# EAGLE design lcd_thermocouple_two (EAGLE 6.0)
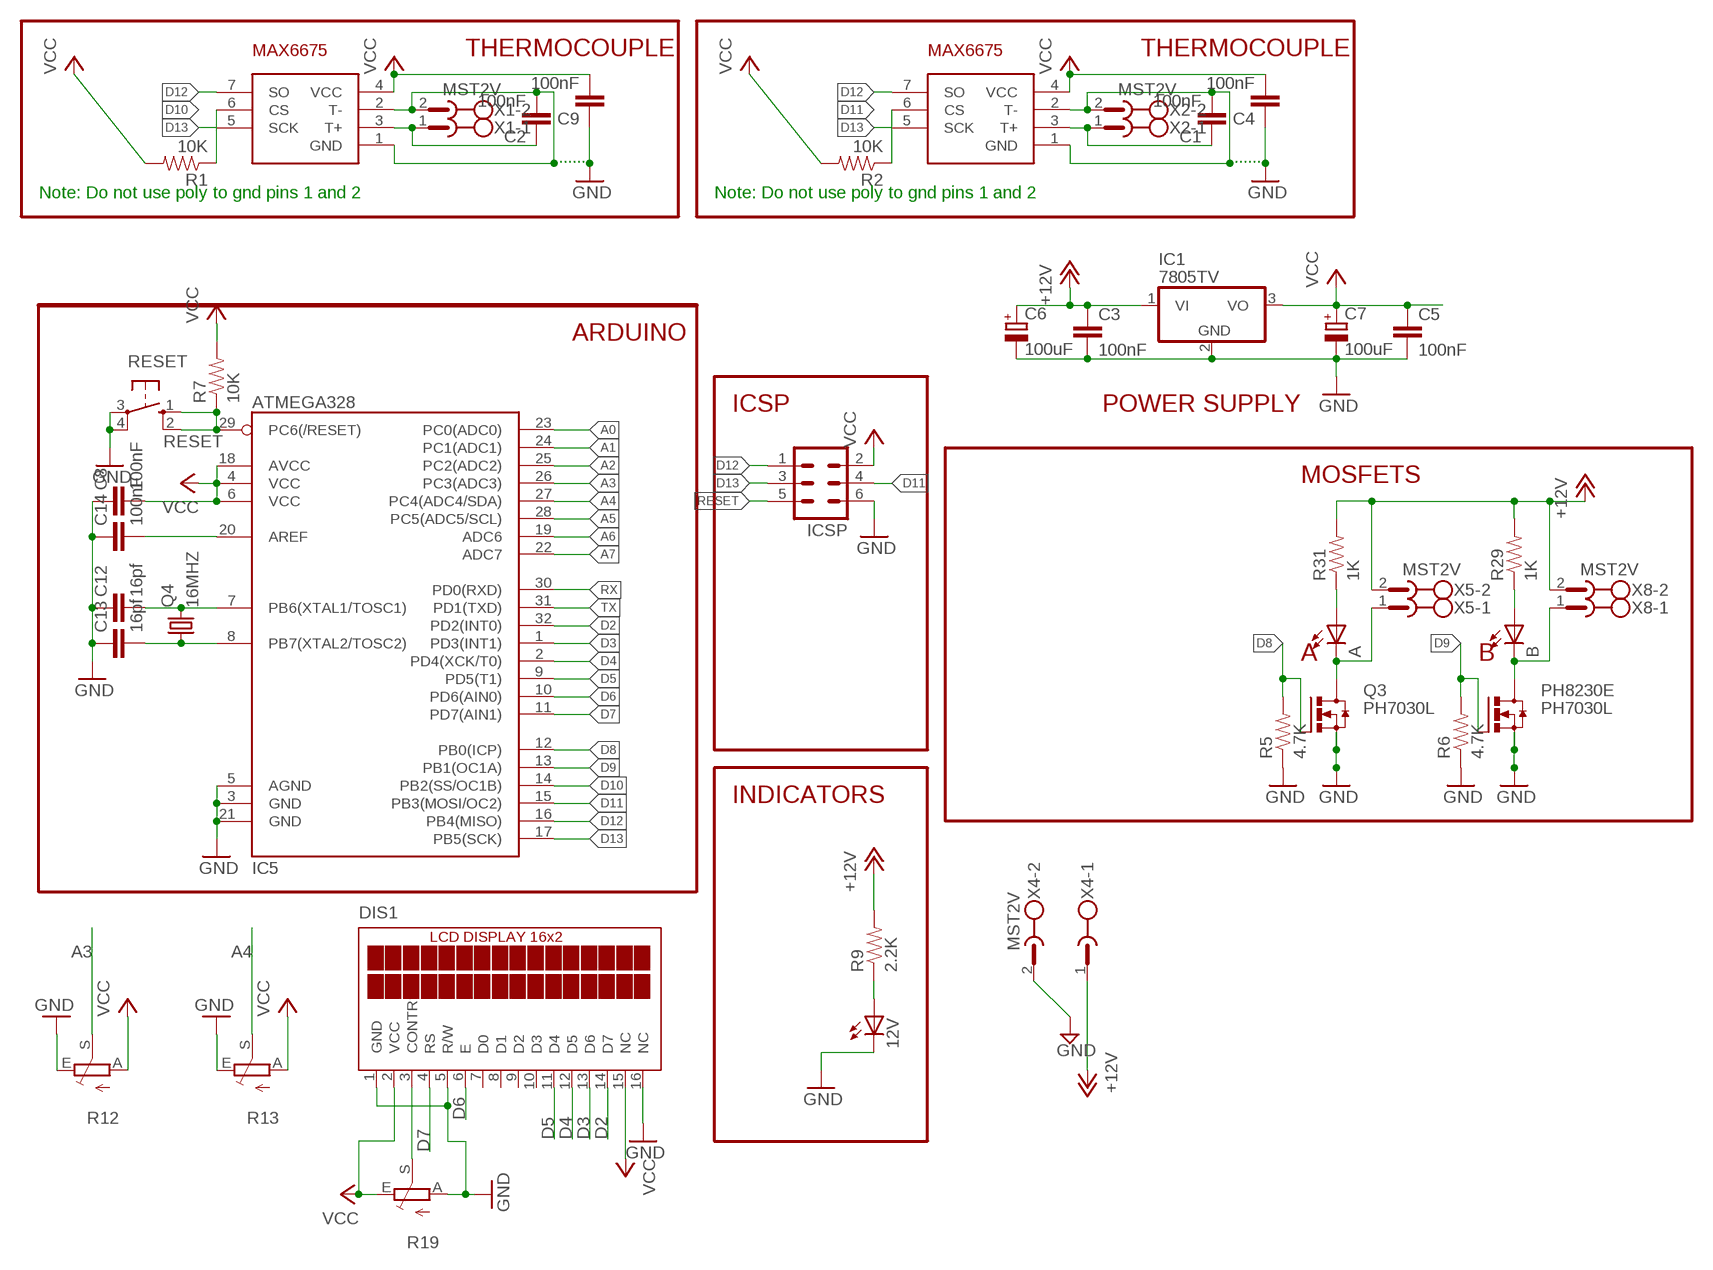
[diagram p0: schematic, sheet 1]

## Parts
12V  LED0805  [LED-0805]
A  LED0805  [LED-0805]
B  LED0805  [LED-0805]
C1  100nF  CAP0805  [0805]
C2  100nF  CAP0805  [0805]
C3  100nF  CAP0805  [0805]
C4  100nF  CAP0805  [0805]
C5  100nF  CAP0805  [0805]
C6  100uF  CPOL-EUE3.5-8  [E3,5-8]
C7  100uF  CPOL-EUE3.5-8  [E3,5-8]
C8  100nF  CAP0805  [0805]
C9  100nF  CAP0805  [0805]
C12  16pf  CAP0805  [0805]
C13  16pf  CAP0805  [0805]
C14  100nF  CAP0805  [0805]
DIS1  TUXGR_16X2_R2  [TUXGR_16X2_R2]
IC1  7805TV  [TO220V]
IC2  MAX6675  [SO08]
IC5  ATMEGA328  ATMEGA168  [TQFP32-08]
IC8  MAX6675  [SO08]
ICSP  ML6  [ML6]
PH8230E  PH7030L  [SOT669]
Q3  PH7030L  [SOT669]
Q4  16MHZ  CRYSTALHC49S  [HC49/S]
R1  10K  RESISTOR  [0805]
R2  10K  RESISTOR  [0805]
R5  4.7K  RESISTOR  [0805]
R6  4.7K  RESISTOR  [0805]
R7  10K  RESISTOR  [0805]
R9  2.2K  RESISTOR  [0805]
R12  TRIM_EU-B25U  [B25U]
R13  TRIM_EU-B25U  [B25U]
R19  TRIM_EU-B25P  [B25P]
R29  1K  RESISTOR  [0805]
R31  1K  RESISTOR  [0805]
RESET  10-XX  [B3F-10XX]
X1  MST2V  [MSTBV2]
X2  MST2V  [MSTBV2]
X4  MST2V  [MSTBV2]
X5  MST2V  [MSTBV2]
X8  MST2V  [MSTBV2]

## Nets
+12V [motors]: C3.1 C6.+ IC1.1(VI) R9.2 R29.2 R31.2 X4.1 X5.2 X8.2
A0: IC5.23(PC0(ADC0))
A1: IC5.24(PC1(ADC1))
A2: IC5.25(PC2(ADC2))
A3: IC5.26(PC3(ADC3)) R12.S
A4: IC5.27(PC4(ADC4/SDA)) R13.S
A5: IC5.28(PC5(ADC5/SCL))
A6: IC5.19(ADC6)
A7: IC5.22(ADC7)
APWR [motors]: A.C Q3.MB(D) X5.1
BPWR [motors]: B.C PH8230E.MB(D) X8.1
D2: DIS1.14(D7) IC5.32(PD2(INT0))
D3: DIS1.13(D6) IC5.1(PD3(INT1))
D4: DIS1.12(D5) IC5.2(PD4(XCK/T0))
D5: DIS1.11(D4) IC5.9(PD5(T1))
D6: DIS1.6(E) IC5.10(PD6(AIN0))
D7: DIS1.4(RS) IC5.11(PD7(AIN1))
D8: IC5.12(PB0(ICP)) Q3.4(G) R5.2
D9: IC5.13(PB1(OC1A)) PH8230E.4(G) R6.2
D10: IC5.14(PB2(SS/OC1B)) IC8.6(CS) R1.1
D11: IC2.6(CS) IC5.15(PB3(MOSI/OC2)) ICSP.4 R2.1
D12: IC2.7(SO) IC5.16(PB4(MISO)) IC8.7(SO) ICSP.1
D13: IC2.5(SCK) IC5.17(PB5(SCK)) IC8.5(SCK) ICSP.3
GND [motors]: 12V.C C3.2 C4.1 C5.2 C6.- C7.- C8.1 C9.1 C12.1 C13.1 C14.1 DIS1.1(GND) DIS1.5(R/W) DIS1.16(NC) IC1.2(GND) IC5.3(GND) IC5.5(AGND) IC5.21(GND) ICSP.6 PH8230E.1(S) PH8230E.2(S) PH8230E.3(S) Q3.1(S) Q3.2(S) Q3.3(S) R5.1 R6.1 R12.E R13.E R19.A RESET.3(P) RESET.4(P1) X4.2
N$1: C2.2 IC8.1(GND) IC8.2(T-) X1.2
N$2: C1.1 IC2.3(T+) X2.1
N$3: C1.2 IC2.1(GND) IC2.2(T-) X2.2
N$11: C2.1 IC8.3(T+) X1.1
N$20: C14.2 IC5.20(AREF)
N$26: 12V.A R9.1
N$29: DIS1.3(CONTR) R19.S
N$31: C12.2 IC5.7(PB6(XTAL1/TOSC1)) Q4.2
N$32: C13.2 IC5.8(PB7(XTAL2/TOSC2)) Q4.1
N$41: A.A R31.1
N$42: B.A R29.1
RESET: IC5.29(PC6(/RESET)) ICSP.5 R7.1 RESET.1(S) RESET.2(S1)
RX: IC5.30(PD0(RXD))
TX: IC5.31(PD1(TXD))
VCC: C4.2 C5.1 C7.+ C8.2 C9.2 DIS1.2(VCC) DIS1.15(NC) IC1.3(VO) IC2.4(VCC) IC5.4(VCC) IC5.6(VCC) IC5.18(AVCC) IC8.4(VCC) ICSP.2 R1.2 R2.2 R7.2 R12.A R13.A R19.E
Unconnected: DIS1.7(D0) DIS1.8(D1) DIS1.9(D2) DIS1.10(D3)

## Notes on the sheet
- THERMOCOUPLE | THERMOCOUPLE
- ....... | .......
- Note: Do not use poly to gnd pins 1 and 2 | Note: Do not use poly to gnd pins 1 and 2
- ARDUINO
- ICSP | POWER SUPPLY
- MOSFETS
- A | B
- INDICATORS

## Library data of the parts
12V A B = SparkFun:LED: LEDs Standard schematic elements and footprints for 5mm, 3mm, 1206, and 0603 sized LEDs. 5mm - Spark Fun Electronics SKU : COM-00529 (and others)
C1-C5 C8 C9 C12-C14 = SparkFun:CAP: Capacitor Standard 0603 ceramic capacitor, and 0.1" leaded capacitor.
C6 C7 = rcl:CPOL-EU: POLARIZED CAPACITOR, European symbol
DIS1 = display-lcd:TUXGR_16X2_R2: Tuxgraphics LCD display 16x2 characters reflective, without background light Source: tuxgr_12x2_r2.pdf
IC1 = linear:78*: Positive VOLTAGE REGULATOR Source: http://cache.national.com/ds/LM/LM78L05.pdf http://www.fairchildsemi.com/ds/LM/LM7805.pdf
IC2 IC8 = reprap:MAX6675: Thermocouple amplifier and A to D converter
IC5 = SparkFun:ATMEGA168
ICSP = con-harting-ml:ML6: HARTING
PH8230E Q3 = transistor-power:PH7030L: N-channel TrenchMOS (TM) logic level FET Source: http://www.nxp.com/acrobat_download/datasheets/PH7030L_4.pdf
Q4 = crystal:CRYSTAL: CRYSTAL
R1 R2 R5-R7 R9 R29 R31 = SparkFun:RESISTOR: Resistor Basic schematic elements and footprints for 0603, 1206, and PTH 1/10th watt (small) resistors.
R12 R13 R19 = pot:TRIM_EU-: POTENTIOMETER
RESET = switch-omron:10-XX: OMRON SWITCH
X1 X2 X4 X5 X8 = con-phoenix-508:MST2V: PHOENIX

## Net classes
0 default: width 0.305 mm
1 vcc: width 0.305 mm
2 motors: width 1.016 mm

## Board
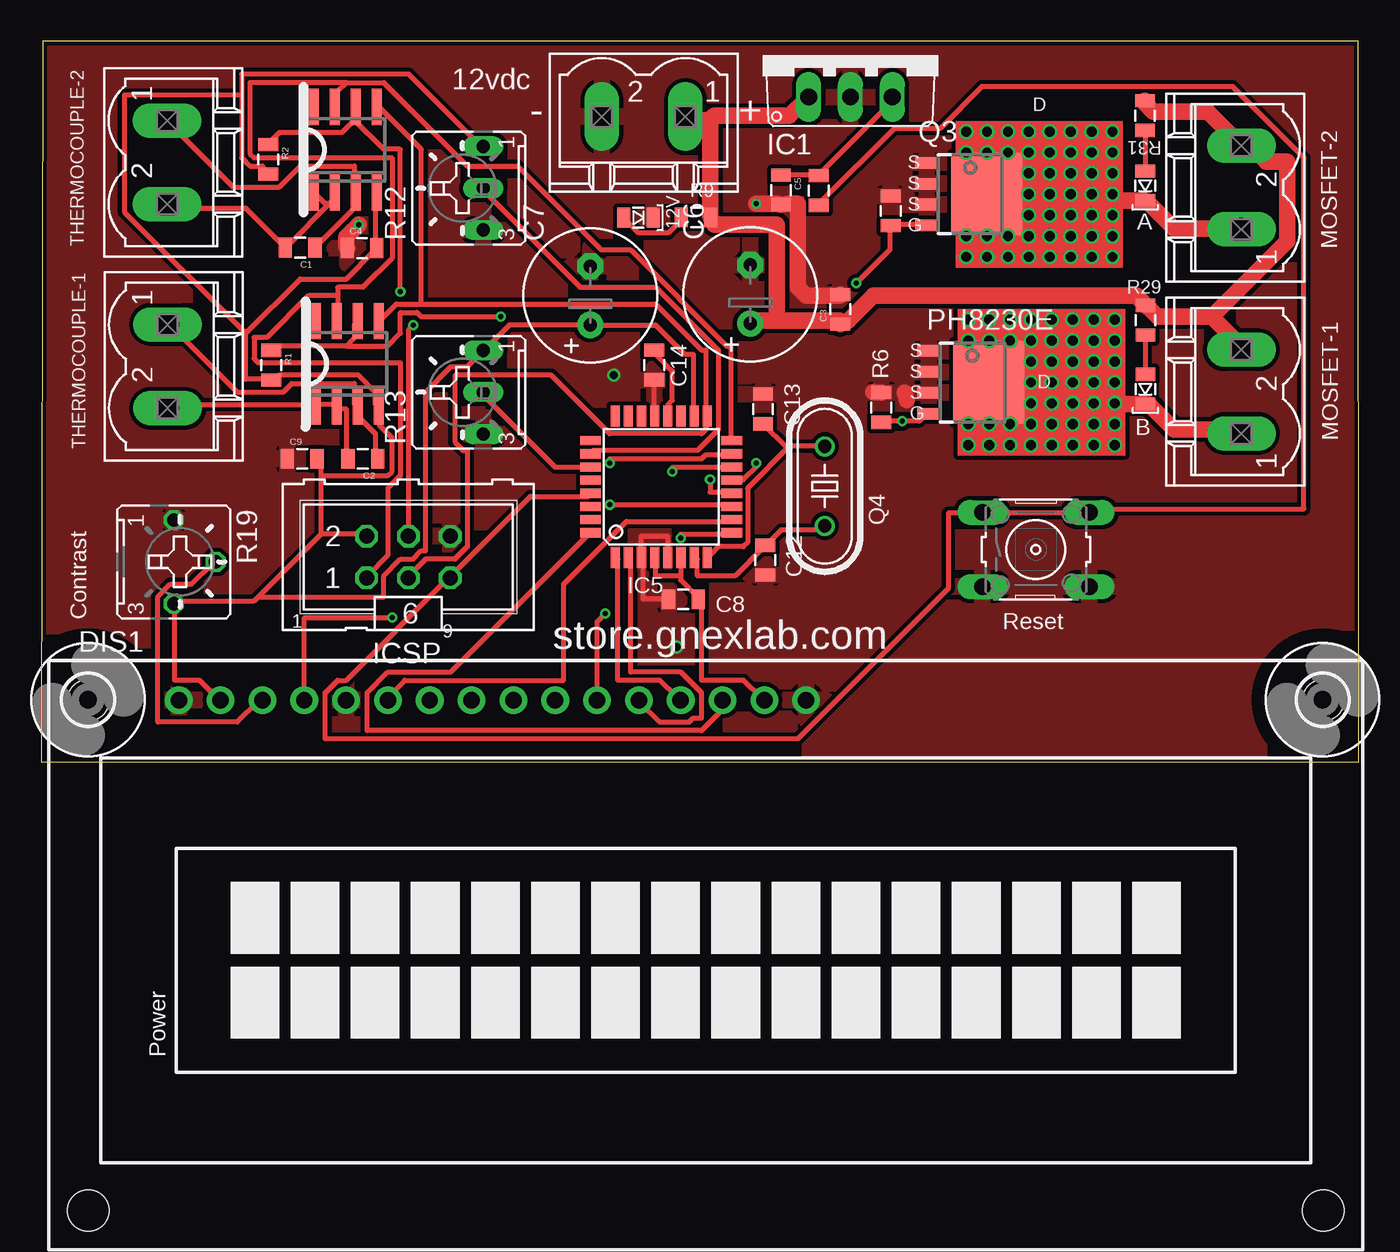
[diagram p1: board, top side]
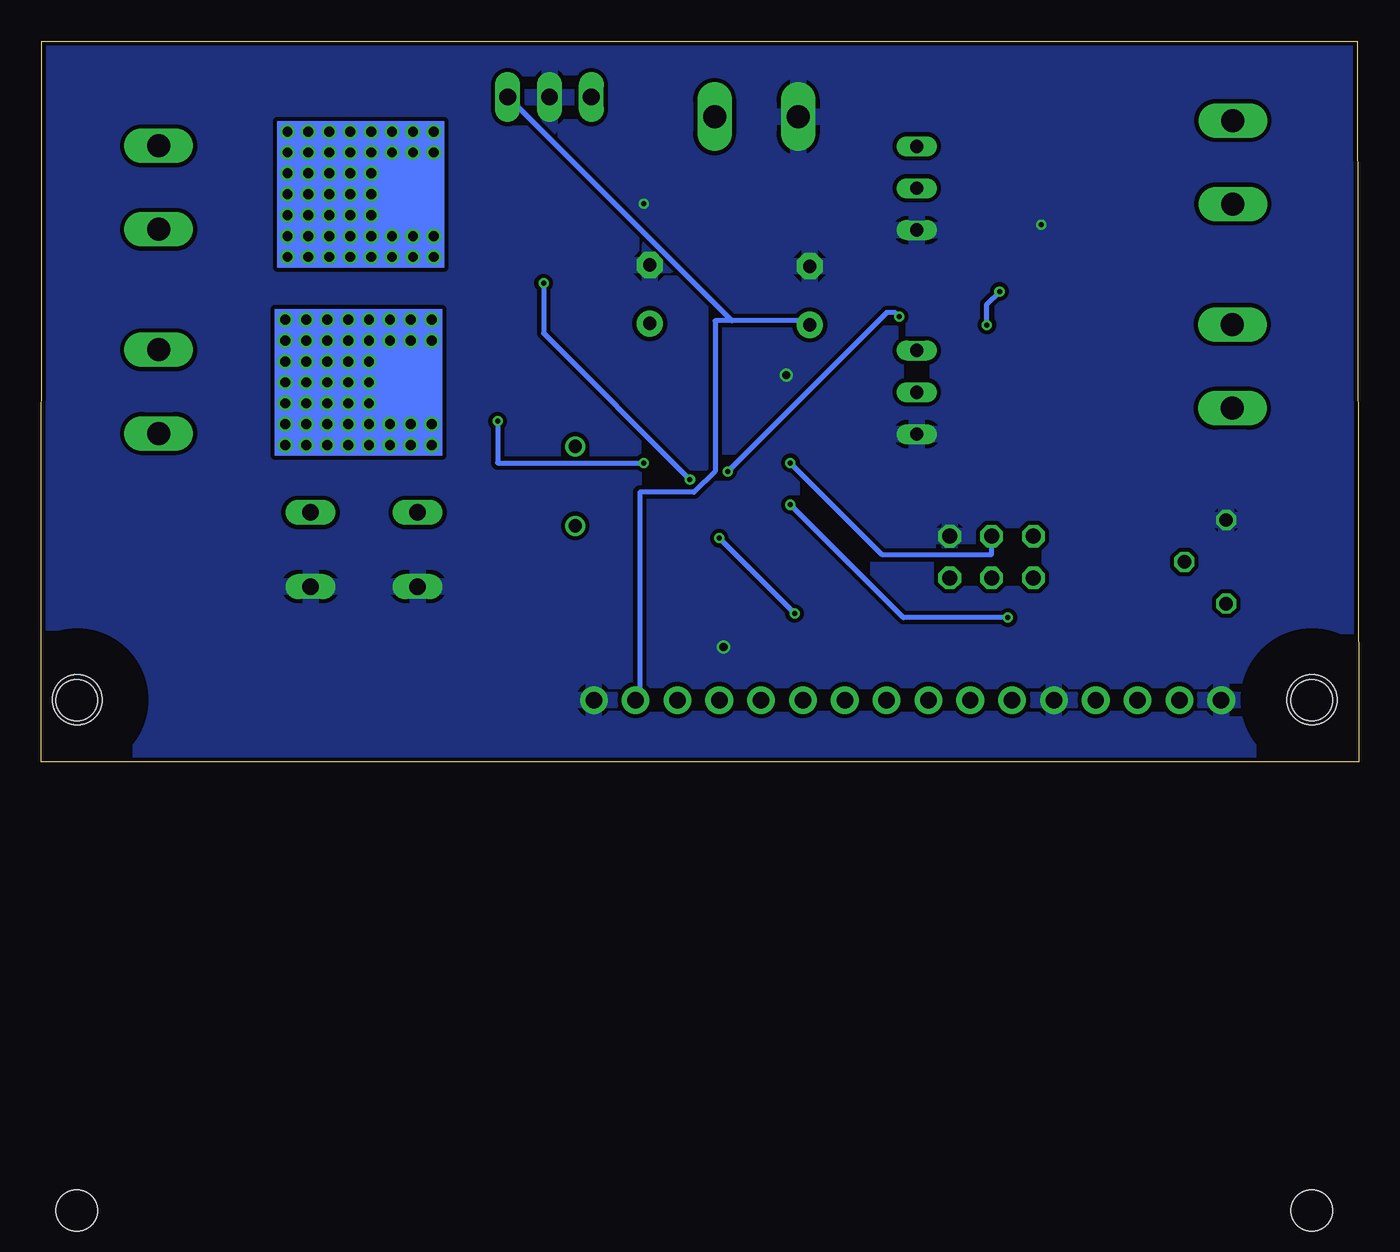
[diagram p2: board, bottom side, seen from below]

Size 80.01 x 43.8 mm. Coordinates in mm from the lower left corner, seen from the top.
Outline: 0,0 80.01,0 79.98,43.8 0.09,43.8 0,0
Copper layers (1*2*15*16): Top 0.035mm / dielectric 0.2mm / Route2 0.0175mm / dielectric 1.1mm / Route15 0.0175mm / dielectric 0.2mm / Bottom 0.035mm
Design rules: minimum track width 6mil, minimum drill 12mil, track to track 6mil, track to pad 6mil, pad to pad 6mil, via to via 6mil, smd to smd 0mil, copper to edge 10mil, drill to drill 10mil, minimum pad ring 6mil, minimum via ring 6mil, stop-mask expansion 2mil, vias tented up to drill 25mil, thermal gap 10mil

### Footprints (pad centres in the part's own frame; a part is rotated, then mirrored left to right if it is on the bottom)
LED-0805 = smd 1.2 x 0.8: A 0,-0.9; C 0,0.9
0805 = smd 0.8 x 1.2: 1 -0.9,0; 2 0.9,0
E3,5-8 = drill 0.813 pad 1.6: + -1.778,0 | drill 0.813 pad 1.6 octagon: - 1.778,0
TUXGR_16X2_R2 = drill 1 pad 1.676: 1 -32,15.5; 2 -29.46,15.5; 3 -26.92,15.5; 4 -24.38,15.5; 5 -21.84,15.5; 6 -19.3,15.5; 7 -16.76,15.5; 8 -14.22,15.5; 9 -11.68,15.5; 10 -9.14,15.5; 11 -6.6,15.5; 12 -4.06,15.5; 13 -1.52,15.5; 14 1.02,15.5; 15 3.56,15.5; 16 6.1,15.5 | hole 2.5: -37.5,-15.5; 37.5,-15.5; -37.5,15.5; 37.5,15.5
TO220V = drill 1.016 long: 1 -2.54,-2.54; 2 0,-2.54; 3 2.54,-2.54
SO08 = smd 0.6 x 2.2: 1 -1.905,-2.6; 2 -0.635,-2.6; 3 0.635,-2.6; 4 1.905,-2.6; 5 1.905,2.6; 6 0.635,2.6; 7 -0.635,2.6; 8 -1.905,2.6
TQFP32-08 = smd 1.27 x 0.559: 1 -4.293,2.8; 2 -4.293,2; 3 -4.293,1.2; 4 -4.293,0.4; 5 -4.293,-0.4; 6 -4.293,-1.2; 7 -4.293,-2; 8 -4.293,-2.8; 17 4.293,-2.8; 18 4.293,-2; 19 4.293,-1.2; 20 4.293,-0.4; 21 4.293,0.4; 22 4.293,1.2; 23 4.293,2; 24 4.293,2.8 | smd 0.559 x 1.27: 9 -2.8,-4.293; 10 -2,-4.293; 11 -1.2,-4.293; 12 -0.4,-4.293; 13 0.4,-4.293; 14 1.2,-4.293; 15 2,-4.293; 16 2.8,-4.293; 25 2.8,4.293; 26 2,4.293; 27 1.2,4.293; 28 0.4,4.293; 29 -0.4,4.293; 30 -1.2,4.293; 31 -2,4.293; 32 -2.8,4.293
ML6 = drill 0.914 octagon: 1 -2.54,-1.27; 2 -2.54,1.27; 3 0,-1.27; 4 0,1.27; 5 2.54,-1.27; 6 2.54,1.27
SOT669 = smd 0.7 x 1.4: 1 -1.905,-2.65; 2 -0.635,-2.65; 3 0.635,-2.65; 4 1.905,-2.65 | smd 5 x 4.3: MB 0,1
HC49/S = drill 0.813: 1 -2.413,0; 2 2.413,0
B25U = drill 0.813 long: A 2.54,-0.889; E -2.54,-0.889; S 0,-0.889
B25P = drill 0.813 octagon: A -2.54,0; E 2.54,0; S 0,2.54
B3F-10XX = drill 1.016 long: 1 -3.251,2.261; 2 3.251,2.261; 3 -3.251,-2.261; 4 3.251,-2.261
3,0 = hole 3: 0,0
MSTBV2 = drill 1.397 long: 1 -2.54,0; 2 2.54,0

### Placement (x,y rotation side)
12V  36.27,33.08 270 top
A  67.04,35.01 180 top
B  67.06,22.66 180 top
C1  15.72,31.26 180 top
C2  19.53,18.43 180 top
C3  48.52,27.51 90 top
C4  19.48,31.23 0 top
C5  44.92,34.76 270 top
C6  43.06,28.42 90 top
C7  33.34,28.35 90 top
C8  39,9.9 0 top
C9  15.85,18.43 0 top
C12  43.97,12.28 90 top
C13  43.84,21.46 270 top
C14  37.24,24.12 90 top
DIS1  40.36,-11.73 0 top
IC1  49.15,42.94 0 top
IC2  18.47,37.2 0 top
IC5  37.65,16.73 90 top
IC8  18.59,24.2 0 top
ICSP  22.3,12.46 0 top
PH8230E  56.55,23.07 270 top
Q3  56.42,34.5 270 top
Q4  47.58,16.77 270 top
R1  13.97,24.12 270 top
R2  13.79,36.62 270 top
R5  51.6,33.49 270 top
R6  51.01,21.55 270 top
R7  47.22,34.73 90 top
R9  39.76,33.09 0 top
R12  25.96,34.87 90 top
R13  25.96,22.47 90 top
R19  8.06,12.17 270 top
R29  67.06,26.85 90 top
R31  67.02,39.28 90 top
RESET  60.41,12.92 0 top
U$1  [3,0]  2.84,3.79 0 top
U$4  [3,0]  77.82,3.79 0 top
X1  7.67,24.04 270 top
X2  7.65,36.44 270 top
X4  36.58,39.22 180 top
X5  72.88,34.91 90 top
X8  72.88,22.51 90 top

### Tracks (layer width: path | path; a pad name or v marks a point on that pad's centre or on a via)
+12V
  Top 1.016: 71.1,27.07 67.79,27.07 67.29,27.57 R29.2 66.78,28.08 66.52,28.34 50.52,28.34 49,26.81 C3.1 48.49,26.81 44.68,26.81 | 71.1,27.07 72.87,25.29 X8.2 | R31.2 67.03,40.02 67.54,39.51 70.84,39.51 72.87,37.48 X5.2 73.38,37.48 74.4,36.46 75.67,36.46 75.67,31.64 71.1,27.07 | 44.68,26.81 43.16,26.81 C6.+ | 40.62,39 40.62,33.16 R9.2 40.87,32.65 44.68,32.65 44.68,26.81 | 40.62,39 39.35,39 X4.1 | IC1.1 46.46,40.27 45.44,39.26 40.87,39.26 40.62,39
A3
  Top 0.305: IC5.26 33.5,18.94 39.85,18.94 41.12,20.21 41.12,25.03 37.31,28.84 32.74,28.84 26.9,34.69 R12.S
A4
  Top 0.305: IC5.27 33.25,17.92 31.22,17.92 26.9,22.24 R13.S
APWR
  Top 1.016: X5.1 72.87,32.4 68.81,32.4 67.29,33.92 A.C 57.42,34.11 Q3.MB
BPWR
  Top 1.016: X8.1 72.87,20.21 68.81,20.21 67.29,21.73 B.C 57.55,21.76 PH8230E.MB
D2
  Top 0.305: IC5.32 33.25,13.86 24.87,5.48 21.06,5.48 19.79,4.21 19.79,1.92 40.11,1.92 41.12,2.94 41.12,3.7 DIS1.14
D3
  Top 0.305: IC5.1 35.03,12.33 35.03,4.97 37.57,4.97 38.58,3.95 DIS1.13
D4
  Top 0.305: IC5.2 35.79,12.33 35.79,5.48 38.84,5.48 40.11,4.21 40.11,2.68 39.6,2.68 39.35,2.43 37.57,2.43 36.3,3.7 DIS1.12
D5  (via drill 0.3)
  Top 0.305: v38.84,13.6 38.84,13.86 41.89,13.86 IC5.9 | v34.27,9.03 33.76,8.52 33.76,3.95 DIS1.11
  Bottom 0.305: v34.27,9.03 v38.84,13.6
D6
  Top 0.305: IC5.10 41.89,14.62 35.54,14.62 31.73,10.81 31.73,4.97 22.07,4.97 21.06,3.95 DIS1.6
D7  (via drill 0.3)
  Top 0.305: v34.52,15.64 41.89,15.64 IC5.11 | v21.31,8.78 15.98,8.78 15.98,3.95 DIS1.4
  Bottom 0.305: v34.52,15.64 27.66,8.78 v21.31,8.78
D8  (via drill 0.3)
  Top 0.305: Q3.4 53.57,32.65 51.79,32.65 R5.2 51.54,32.4 51.54,31.13 v49.51,29.1 | v40.62,17.16 40.62,16.4 41.89,16.4 IC5.12
  Bottom 0.305: v40.62,17.16 49.51,26.05 v49.51,29.1
D9  (via drill 0.3)
  Top 0.305: R6.2 51.03,20.72 v52.3,20.72 53.32,20.72 53.82,21.22 PH8230E.4 | v43.41,18.18 43.41,17.92 42.65,17.16 42.14,17.16 IC5.13
  Bottom 0.305: v43.41,18.18 52.3,18.18 v52.3,20.72
D10  (via drill 0.3)
  Top 0.305: 18.52,25.29 14.45,25.29 14.2,25.03 R1.1 | 18.52,25.29 19.03,25.8 19.03,26.56 IC8.6 | v38.33,17.67 38.33,17.92 41.89,17.92 IC5.14 | v27.92,27.07 23.09,27.07 22.84,27.32 21.82,27.32 21.82,26.05 21.06,25.29 18.52,25.29
  Bottom 0.305: v38.33,17.67 28.68,27.32 28.17,27.32 v27.92,27.07
D11  (via drill 0.3)
  Top 0.305: 19.03,39 18.26,38.24 14.45,38.24 13.95,37.73 R2.1 | 19.03,39 19.03,39.77 IC2.6 19.03,39 | v34.52,18.18 34.52,18.43 40.11,18.43 40.36,18.68 41.89,18.68 IC5.15 | 19.03,39 20.8,37.23 21.82,37.23 v21.82,28.59 | v22.58,26.56 22.33,26.3 22.33,13.86 ICSP.4
  Bottom 0.305: v34.52,18.18 28.93,12.59 22.33,12.59 22.33,13.6 ICSP.4 | v21.82,28.59 22.58,27.83 v22.58,26.56
D12
  Top 0.305: 18.52,41.29 20.8,41.29 25.88,36.21 28.93,36.21 34.01,31.13 35.79,31.13 41.63,25.29 41.89,25.29 41.89,19.7 IC5.16 | 18.52,41.29 18.01,40.78 18.01,40.02 IC2.7 | 18.01,28.34 18.01,28.84 19.53,28.84 21.31,30.62 21.31,36.72 12.93,36.72 12.68,36.97 12.68,41.29 18.52,41.29 | 18.01,28.34 18.01,26.81 IC8.7 | 18.01,28.34 16.23,28.34 13.69,25.8 12.93,25.8 12.93,24.53 13.18,24.27 21.82,24.27 21.82,17.41 21.06,16.65 21.06,12.59 19.79,11.32 ICSP.1
D13
  Top 0.305: 23.09,27.83 21.57,27.83 20.55,26.81 IC8.5 | 23.09,27.83 37.31,27.83 40.11,25.03 40.36,25.03 40.36,21.22 IC5.17 40.36,20.97 40.36,20.21 40.11,19.95 34.52,19.95 30.96,23.51 25.12,23.51 25.12,19.45 25.63,18.94 25.88,18.94 25.88,13.1 25.12,12.33 23.34,12.33 22.33,11.32 ICSP.3 | 23.09,27.83 23.09,37.23 20.55,39.77 IC2.5
GND  (via drill 0.3, 0.5)
  Top 0.305: 37.24,21.02 C14.1 | 36.42,12.44 36.42,13.73 38.05,13.73 IC5.5 | C8.1 36.55,9.9 36.55,12.44
  Top 0.406: IC5.21 37.24,21.02 | 36.42,12.44 IC5.3 36.55,12.44
  Top 1.016: v19.28,32.65 18.52,31.89 18.52,31.38 C4.1 | v43.41,33.92 44.68,33.92 C5.2 45.44,33.92 45.95,33.92 45.95,28.84 46.46,28.34 48.49,28.34 C3.2 | 52.55,21.99 52.44,22.44 | 50.52,22.49 R6.1 | 8.36,3.95 DIS1.1 | 8.36,3.95 DIS1.1 | 8.36,3.95 DIS1.1
  other vias: 34.77,23.51 38.58,7
  pour Top (isolate 0.254): -12.46,46.06 83.52,44.86 83.33,-7.61 -12.14,-7.5
  pour Bottom (isolate 0.254): -6.14,46.77 81.66,47.21 80.54,-4.03 -6.61,-4.89
N$1
  Top 0.305: C2.2 18.52,18.43 18.52,21.48 18.01,21.48 IC8.2 17.76,21.73 16.74,21.73 IC8.1 16.49,21.73 7.85,21.73 X1.2
N$2
  Top 0.305: C1.1 16.74,31.38 19.03,33.67 19.03,34.43 IC2.3 19.03,34.69 19.03,36.21 15.72,36.21 14.45,34.94 11.66,34.94 7.85,38.75 X2.1
N$3
  Top 0.305: 17.5,33.92 18.01,34.43 IC2.2 | 17.5,33.92 14.96,31.38 C1.2 14.71,31.38 12.42,33.67 7.85,33.67 X2.2 | 17.5,33.92 17.25,33.92 16.74,34.43 IC2.1
N$10  (via drill 0.6 pad 0)
  other vias: 56.17,38.31
N$11
  Top 0.305: C2.1 20.3,18.43 20.3,19.95 19.28,20.97 19.28,21.48 IC8.3 19.03,21.73 19.03,23 15.22,23 14.71,22.49 11.91,22.49 7.85,26.56 X1.1
N$13  (via drill 0.6 pad 0)
  other vias: 57.44,38.31
N$14  (via drill 0.6 pad 0)
  other vias: 58.71,38.31
N$15  (via drill 0.6 pad 0)
  other vias: 59.98,38.31
N$16  (via drill 0.6 pad 0)
  other vias: 61.25,38.31
N$17  (via drill 0.6 pad 0)
  other vias: 62.52,38.31
N$19  (via drill 0.6 pad 0)
  other vias: 63.79,38.31
N$20
  Top 0.305: C14.2 37.31,24.78 38.33,23.76 38.33,21.99 38.08,21.73 38.08,21.22 IC5.20
N$21  (via drill 0.6 pad 0)
  other vias: 65.06,38.31
N$22  (via drill 0.6 pad 0)
  other vias: 65.06,37.04
N$24  (via drill 0.6 pad 0)
  other vias: 63.79,37.04
N$26
  Top 0.305: 12V.A 35.54,32.91 36.3,32.15 38.08,32.15 38.84,32.91 R9.1
N$27  (via drill 0.6 pad 0)
  other vias: 62.52,37.04
N$28  (via drill 0.6 pad 0)
  other vias: 61.25,37.04
N$29
  Top 0.305: R19.S 10.39,12.08 9.12,10.81 7.85,10.81 7.09,10.05 7.09,2.43 11.91,2.43 13.18,3.7 DIS1.3
N$31
  Top 0.305: Q4.2 47.47,14.11 44.93,14.11 44.17,13.35 C12.2 43.92,13.1 42.14,11.32 39.85,11.32 39.85,12.33 IC5.7
N$32
  Top 0.305: 45.44,19.19 47.47,19.19 Q4.1 | 45.44,19.19 45.19,19.19 43.92,20.46 C13.2 | 45.44,19.19 42.9,16.65 42.9,13.35 42.65,13.1 41.12,13.1 40.62,12.59 IC5.8
N$33  (via drill 0.6 pad 0)
  other vias: 59.98,37.04
N$34  (via drill 0.6 pad 0)
  other vias: 58.71,37.04
N$35  (via drill 0.6 pad 0)
  other vias: 57.44,37.04
N$41
  Top 0.305: A.A 67.03,35.96 67.03,38.24 R31.1
N$42
  Top 0.305: B.A 67.03,23.76 67.03,25.8 R29.1
N$43  (via drill 0.6 pad 0)
  other vias: 56.17,37.04
N$54  (via drill 0.6 pad 0)
  other vias: 59.98,35.77
N$55  (via drill 0.6 pad 0)
  other vias: 61.25,35.77
N$56  (via drill 0.6 pad 0)
  other vias: 62.52,35.77
N$57  (via drill 0.6 pad 0)
  other vias: 63.79,35.77
N$58  (via drill 0.6 pad 0)
  other vias: 65.06,35.77
N$62  (via drill 0.6 pad 0)
  other vias: 59.98,34.5
N$63  (via drill 0.6 pad 0)
  other vias: 61.25,34.5
N$64  (via drill 0.6 pad 0)
  other vias: 62.52,34.5
N$65  (via drill 0.6 pad 0)
  other vias: 63.79,34.5
N$66  (via drill 0.6 pad 0)
  other vias: 65.06,34.5
N$70  (via drill 0.6 pad 0)
  other vias: 59.98,33.23
N$71  (via drill 0.6 pad 0)
  other vias: 61.25,33.23
N$72  (via drill 0.6 pad 0)
  other vias: 62.52,33.23
N$73  (via drill 0.6 pad 0)
  other vias: 63.79,33.23
N$74  (via drill 0.6 pad 0)
  other vias: 65.06,33.23
N$75  (via drill 0.6 pad 0)
  other vias: 65.06,31.96
N$76  (via drill 0.6 pad 0)
  other vias: 63.79,31.96
N$77  (via drill 0.6 pad 0)
  other vias: 62.52,31.96
N$78  (via drill 0.6 pad 0)
  other vias: 61.25,31.96
N$79  (via drill 0.6 pad 0)
  other vias: 59.98,31.96
N$80  (via drill 0.6 pad 0)
  other vias: 58.71,31.96
N$81  (via drill 0.6 pad 0)
  other vias: 57.44,31.96
N$82  (via drill 0.6 pad 0)
  other vias: 56.17,31.96
N$84  (via drill 0.6 pad 0)
  Top 0.61: v56.17,30.69 v57.44,30.69
N$85  (via drill 0.6 pad 0)
  other vias: 58.71,30.69
N$86  (via drill 0.6 pad 0)
  other vias: 59.98,30.69
N$87  (via drill 0.6 pad 0)
  other vias: 61.25,30.69
N$88  (via drill 0.6 pad 0)
  other vias: 62.52,30.69
N$89  (via drill 0.6 pad 0)
  other vias: 63.79,30.69
N$90  (via drill 0.6 pad 0)
  other vias: 65.06,30.69
N$91  (via drill 0.6 pad 0)
  other vias: 56.3,26.88
N$92  (via drill 0.6 pad 0)
  other vias: 57.57,26.88
N$93  (via drill 0.6 pad 0)
  other vias: 58.84,26.88
N$94  (via drill 0.6 pad 0)
  other vias: 60.11,26.88
N$95  (via drill 0.6 pad 0)
  other vias: 61.38,26.88
N$96  (via drill 0.6 pad 0)
  other vias: 62.65,26.88
N$97  (via drill 0.6 pad 0)
  other vias: 63.92,26.88
N$98  (via drill 0.6 pad 0)
  other vias: 65.19,26.88
N$99  (via drill 0.6 pad 0)
  other vias: 65.19,25.61
N$100  (via drill 0.6 pad 0)
  other vias: 63.92,25.61
N$101  (via drill 0.6 pad 0)
  other vias: 62.65,25.61
N$102  (via drill 0.6 pad 0)
  other vias: 61.38,25.61
N$103  (via drill 0.6 pad 0)
  other vias: 60.11,25.61
N$104  (via drill 0.6 pad 0)
  other vias: 58.84,25.61
N$105  (via drill 0.6 pad 0)
  other vias: 57.57,25.61
N$106  (via drill 0.6 pad 0)
  other vias: 56.3,25.61
N$110  (via drill 0.6 pad 0)
  other vias: 60.11,24.34
N$111  (via drill 0.6 pad 0)
  other vias: 61.38,24.34
N$112  (via drill 0.6 pad 0)
  other vias: 62.65,24.34
N$113  (via drill 0.6 pad 0)
  other vias: 63.92,24.34
N$114  (via drill 0.6 pad 0)
  other vias: 65.19,24.34
N$115  (via drill 0.6 pad 0)
  other vias: 65.19,23.07
N$116  (via drill 0.6 pad 0)
  other vias: 63.92,23.07
N$117  (via drill 0.6 pad 0)
  other vias: 62.65,23.07
N$118  (via drill 0.6 pad 0)
  other vias: 61.38,23.07
N$119  (via drill 0.6 pad 0)
  other vias: 60.11,23.07
N$126  (via drill 0.6 pad 0)
  other vias: 60.11,21.8
N$127  (via drill 0.6 pad 0)
  other vias: 61.38,21.8
N$128  (via drill 0.6 pad 0)
  other vias: 62.65,21.8
N$129  (via drill 0.6 pad 0)
  other vias: 63.92,21.8
N$130  (via drill 0.6 pad 0)
  other vias: 65.19,21.8
N$131  (via drill 0.6 pad 0)
  other vias: 56.3,20.53
N$132  (via drill 0.6 pad 0)
  other vias: 57.57,20.53
N$133  (via drill 0.6 pad 0)
  other vias: 58.84,20.53
N$134  (via drill 0.6 pad 0)
  other vias: 60.11,20.53
N$135  (via drill 0.6 pad 0)
  other vias: 61.38,20.53
N$136  (via drill 0.6 pad 0)
  other vias: 62.65,20.53
N$137  (via drill 0.6 pad 0)
  other vias: 63.92,20.53
N$138  (via drill 0.6 pad 0)
  other vias: 65.19,20.53
N$139  (via drill 0.6 pad 0)
  other vias: 65.19,19.26
N$140  (via drill 0.6 pad 0)
  other vias: 63.92,19.26
N$141  (via drill 0.6 pad 0)
  other vias: 62.65,19.26
N$142  (via drill 0.6 pad 0)
  other vias: 61.38,19.26
N$143  (via drill 0.6 pad 0)
  other vias: 60.11,19.26
N$144  (via drill 0.6 pad 0)
  other vias: 58.84,19.26
N$145  (via drill 0.6 pad 0)
  other vias: 57.57,19.26
N$146  (via drill 0.6 pad 0)
  other vias: 56.3,19.26
RESET
  Top 0.305: IC5.29 33.25,16.14 29.69,16.14 24.87,11.32 ICSP.5 24.61,11.06 18.52,4.97 18.01,4.97 17.25,4.21 17.25,1.41 45.95,1.41 55.09,10.56 55.09,15.13 57.13,15.13 RESET.1 57.38,15.13 63.48,15.13 RESET.2 63.73,15.38 76.68,15.38 76.68,36.72 72.37,41.04 57.13,41.04 54.59,38.5 51.79,38.5 47.22,33.92 R7.1
VCC
  Top 0.305: 20.55,34.69 IC2.4 20.3,34.43 20.3,31.38 C4.2 20.3,31.13 18.52,29.35 15.72,29.35 12.42,26.05 | IC8.4 20.3,21.73 20.3,22.49 19.28,23.51 14.45,23.51 14.2,23.26 R1.2 13.95,23.26 12.42,23.26 12.42,26.05 | 20.55,21.73 IC8.4 | IC5.18 39.6,21.22 39.6,24.78 39.09,24.78 37.31,26.56 33.5,26.56 C7.+ 33.25,26.56 28.42,26.56 26.9,25.03 R13.A 26.65,24.78 25.88,24.02 24.87,24.02 23.34,22.49 23.34,12.84 23.09,12.84 22.58,12.33 21.82,12.33 20.8,11.32 20.8,10.05 13.18,10.05 | 16.99,13.86 16.99,17.41 | 16.99,17.41 16.99,18.43 C9.2 | 16.99,13.86 19.53,13.86 ICSP.2 | DIS1.2 10.64,3.95 9.63,4.97 8.1,4.97 8.1,9.54 R19.E 8.1,9.79 12.93,9.79 13.18,10.05 | 13.18,10.05 16.99,13.86 | 16.99,17.41 21.06,17.41 21.31,17.67 21.31,19.7 20.55,20.46 20.55,21.48 IC8.4 | 38.84,11.32 38.84,12.33 IC5.6 | 38.84,11.32 38.84,11.06 39.85,10.05 C8.2 40.11,9.79 40.11,4.97 42.65,4.97 43.66,3.95 DIS1.15 | 38.84,11.32 37.31,11.32 37.31,12.33 IC5.4 | C5.1 44.93,35.7 46.97,35.7 R7.2 47.22,35.7 51.79,40.27 IC1.3 | 12.17,40.53 12.17,41.8 22.33,41.8 26.65,37.48 R12.A | 12.17,40.53 12.17,36.72 12.68,36.21 13.44,36.21 13.69,35.96 R2.2 | 12.42,26.05 5.06,33.42 5.06,40.53 12.17,40.53
  Bottom 0.305: 38.08,26.81 51.54,40.27 IC1.3 | 38.08,26.81 33.5,26.81 C7.+ | 38.08,26.81 39.09,26.81 39.09,17.67 40.36,16.4 43.66,16.4 43.66,3.95 DIS1.15
(copper drawn outside any net)
  shapes: Bottom area x2, Top area x2

### Text on the board
tPlace: 1 | 12vdc | D | - | + | S | S | S | G | THERMOCOUPLE-2 | MOSFET-2 | S | S | S | D | G | THERMOCOUPLE-1 | MOSFET-1 | Contrast | 1 | Reset | 9 | store.gnexlab.com | Power